# EAGLE schematic main_board (EAGLE 6.3)
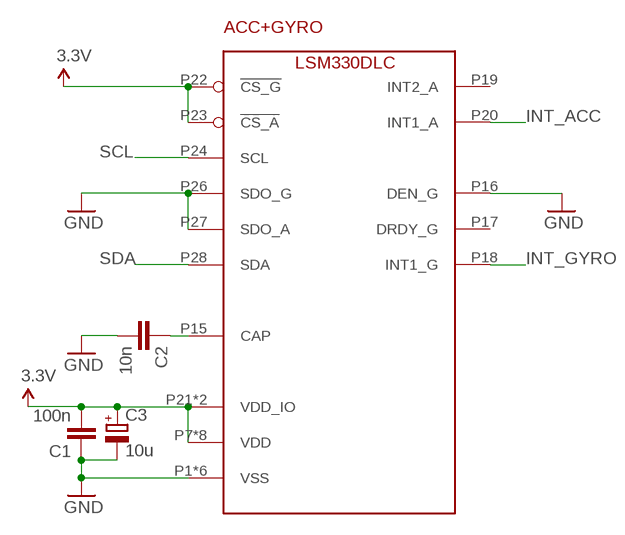
[diagram p0: schematic, sheet 1]

## Parts
ACC+GYRO  LSM330DLC  [LGA_4X5X1P1_28L]
C1  100n  C-EUC0805  [C0805]
C2  10n  C-EUC0805  [C0805]
C3  10u  CPOL-EUSMCA  [SMC_A]

## Nets
3.3V: ACC+GYRO.P7(VDD) ACC+GYRO.P8(VDD) ACC+GYRO.P9(VDD) ACC+GYRO.P10(VDD) ACC+GYRO.P11(VDD) ACC+GYRO.P12(VDD) ACC+GYRO.P13(VDD) ACC+GYRO.P14(VDD) ACC+GYRO.P21(VDD_IO) ACC+GYRO.P22(!CS_G) ACC+GYRO.P23(!CS_A) ACC+GYRO.P25(VDD_IO) C1.2 C3.+
GND: ACC+GYRO.P1(VSS) ACC+GYRO.P2(VSS) ACC+GYRO.P3(VSS) ACC+GYRO.P4(VSS) ACC+GYRO.P5(VSS) ACC+GYRO.P6(VSS) ACC+GYRO.P16(DEN_G) ACC+GYRO.P26(SDO_G) ACC+GYRO.P27(SDO_A) C1.1 C2.2 C3.-
INT_ACC: ACC+GYRO.P20(INT1_A)
INT_GYRO: ACC+GYRO.P18(INT1_G)
N$1: ACC+GYRO.P15(CAP) C2.1
SCL: ACC+GYRO.P24(SCL)
SDA: ACC+GYRO.P28(SDA)
Unconnected: ACC+GYRO.P17(DRDY_G) ACC+GYRO.P19(INT2_A)

## Library data of the parts
ACC+GYRO = sensors-akc_zyr:LSM330DLC
C1 C2 = resistor:C-EU: CAPACITOR, European symbol
C3 = rcl:CPOL-EU: POLARIZED CAPACITOR, European symbol